# EAGLE schematic Sensor_IMU_MPU-6000_SPI (EAGLE 6.1)
Inertial Measurement Unit via SPI MPU-6000 <http://www.invensense.com/mems/gyro/documents/PS-MPU-6000A.pdf> Connect IMU_CS_x to the cable select Rxx pin Connect IMU_MOSI_x to MOSI RPx pin Connect IMU_SCLK_x to the SPI clock PRx pin Connect IMU_MISO_x to MISO PRIx pin Connect IMU_IRQ_x to the Interrupt Request Rxx pin This block includes all supply bypass capacitors.
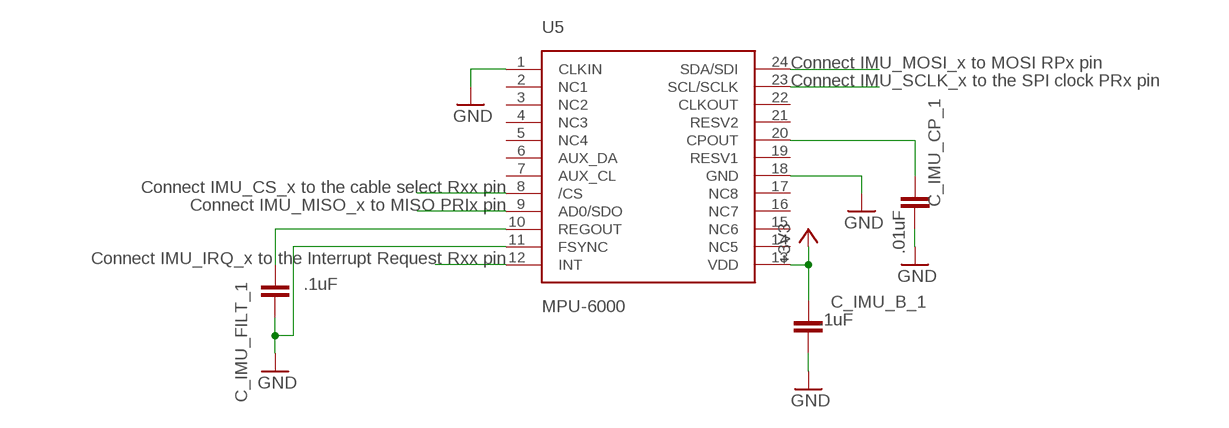
[diagram p0: schematic, sheet 1]

## Parts
C_IMU_B_1  .1uF  CAP0402-CAP  [0402-CAP]
C_IMU_CP_1  .01uF  CAP0402-CAP  [0402-CAP]
C_IMU_FILT_1  .1uF  CAP0402-CAP  [0402-CAP]
U5  MPU-6000  MPU-3000  [QFN-24]

## Nets
+3V3: C_IMU_B_1.2 U5.13(VDD)
GND: C_IMU_B_1.1 C_IMU_CP_1.1 C_IMU_FILT_1.1 U5.1(CLKIN) U5.11(FSYNC) U5.18(GND)
IMU_CS_1: U5.8(/CS)
IMU_IRQ_1: U5.12(INT)
IMU_MISO_1: U5.9(AD0/SDO)
IMU_MOSI_1: U5.24(SDA/SDI)
IMU_SCLK_1: U5.23(SCL/SCLK)
N$2: C_IMU_CP_1.2 U5.20(CPOUT)
N$3: C_IMU_FILT_1.2 U5.10(REGOUT)
Unconnected: U5.2(NC1) U5.3(NC2) U5.4(NC3) U5.5(NC4) U5.6(AUX_DA) U5.7(AUX_CL) U5.14(NC5) U5.15(NC6) U5.16(NC7) U5.17(NC8) U5.19(RESV1) U5.21(RESV2) U5.22(CLKOUT)

## Notes on the sheet
- Connect IMU_MOSI_x to MOSI RPx pin
- Connect IMU_SCLK_x to the SPI clock PRx pin
- Connect IMU_CS_x to the cable select Rxx pin
- Connect IMU_MISO_x to MISO PRIx pin
- Connect IMU_IRQ_x to the Interrupt Request Rxx pin

## Library data of the parts
C_IMU_B_1 C_IMU_CP_1 C_IMU_FILT_1 = SparkFun:CAP: Capacitor Standard 0603 ceramic capacitor, and 0.1" leaded capacitor.
U5 = 3DRobotics_Master_Library:MPU-3000: Invensense MPU-3000 Motion Processing Unit The MPU-30X0 Motion Processing Unit (MPU?) is the world?s first motion processing solution with integrated 6-axis sensor fusion for smart phone applications. The MPU-30X0 has an embedded 3- axis gyroscope and Digital Motion Processor? (DMP) hardware accelerator engine with a secondary I 2 C port that interfaces to third party digital accelerometers to deliver a complete 6-axis sensor fusion output to its primary I 2 C port. This combines both linear and rotational motion into a single data stream for the application.; DATASHEET: http://invensense.com/mems/gyro/documents/PS-MPU-3000A-00_v2.6.pdf; LINK: http://www.invensense.com/mems/gyro/mpu3000.html; MFGPN: MPU-3000

## Net classes
0 default: width 0.178 mm, drill 0.381 mm, clearance 0.178 mm